# EAGLE design board (EAGLE 8.1.0)
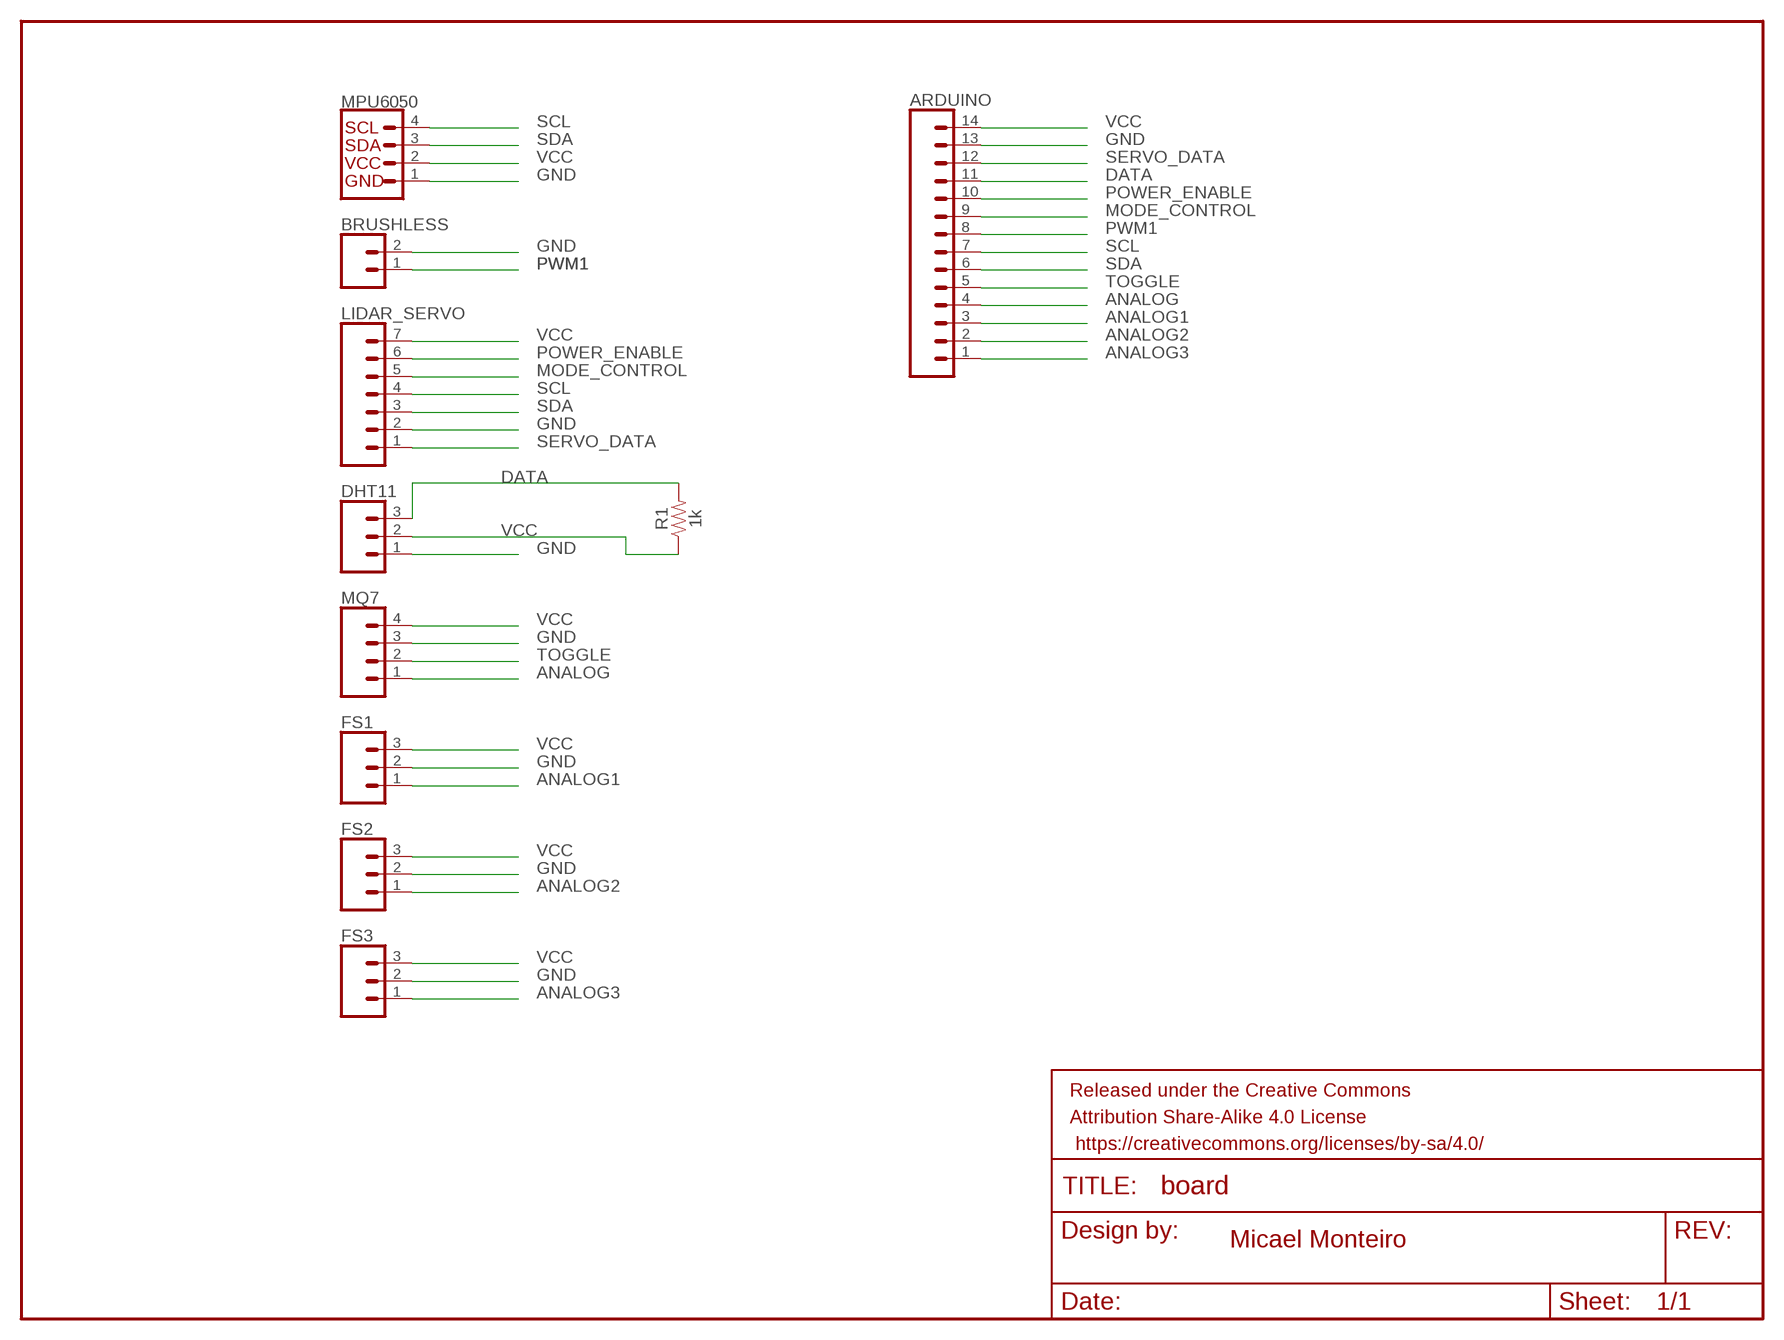
[diagram p0: schematic, sheet 1]

## Parts
ARDUINO  CONN_14  [1X14]
BRUSHLESS  CONN_02  [1X02]
DHT11  CONN_03  [1X03]
FRAME1  FRAME-LETTER  [CREATIVE_COMMONS]
FS1  CONN_03  [1X03]
FS2  CONN_03  [1X03]
FS3  CONN_03  [1X03]
LIDAR_SERVO  CONN_07  [1X07]
MPU6050  I2C_STANDARD  [1X04]
MQ7  CONN_04  [1X04]
R1  1k  1KOHM-0603-1/10W-1%  [0603]

## Nets
ANALOG: ARDUINO.4 MQ7.1
ANALOG1: ARDUINO.3 FS1.1
ANALOG2: ARDUINO.2 FS2.1
ANALOG3: ARDUINO.1 FS3.1
DATA: ARDUINO.11 DHT11.3 R1.2
GND: ARDUINO.13 BRUSHLESS.2 DHT11.1 FS1.2 FS2.2 FS3.2 LIDAR_SERVO.2 MPU6050.1 MQ7.3
MODE_CONTROL: ARDUINO.9 LIDAR_SERVO.5
POWER_ENABLE: ARDUINO.10 LIDAR_SERVO.6
PWM1: ARDUINO.8 BRUSHLESS.1
SCL: ARDUINO.7 LIDAR_SERVO.4 MPU6050.4
SDA: ARDUINO.6 LIDAR_SERVO.3 MPU6050.3
SERVO_DATA: ARDUINO.12 LIDAR_SERVO.1
TOGGLE: ARDUINO.5 MQ7.2
VCC: ARDUINO.14 DHT11.2 FS1.3 FS2.3 FS3.3 LIDAR_SERVO.7 MPU6050.2 MQ7.4 R1.1

## Notes on the sheet
- Micael Monteiro

## Library data of the parts
ARDUINO = SparkFun-Connectors:CONN_14: Multi connection point. Often used as Generic Header-pin footprint for 0.1 inch spaced/style header connections On any of the 0.1 inch spaced packages, you can populate with these: Break Away Headers - Straight <https://www.sparkfun.com/products/116> (PRT-00116) Break Away Male Headers - Right Angle <https://www.sparkfun.com/products/553> (PRT-00553) Female Headers <https://www.sparkfun.com/products/115> (PRT-00115) Break Away Headers - Machine Pin <https://www.sparkfun.com/products/117> (PRT-00117) Break Away Female Headers - Swiss Machine Pin <https://www.sparkfun.com/products/743> (PRT-00743) For SCREWTERMINALS and SPRING TERMINALS visit here: Screw Terimnals on SparkFun.com <https://www.sparkfun.com/search/results?term=Screw+Terminals> (5mm/3.5mm/2.54mm spacing) This device is also useful as a general connection point to wire up your design to another part of your project. Our various solder wires solder well into these plated through hole pads. Hook-Up Wire - Assortment (Stranded, 22 AWG) <https://www.sparkfun.com/products/11375> (PRT-11375) Hook-Up Wire - Assortment (Solid Core, 22 AWG) <https://www.sparkfun.com/products/11367> (PRT-11367) View the entire wire category on our website here <https://www.sparkfun.com/categories/141> Special notes: Molex polarized connector foot print use with SKU : PRT-08231 with associated crimp pins and housings. 1MM SMD Version SKU: PRT-10208 NOTES ON THE VARIANTS LOCK and LOCK_LONGPADS... This footprint was designed to help hold the alignment of a through-hole component (i.e. 6-pin header) while soldering it into place. You may notice that each hole has been shifted either up or down by 0.005 of an inch from it's more standard position (which is a perfectly straight line). This slight alteration caused the pins (the squares in the middle) to touch the edges of the holes. Because they are alternating, it causes a "brace" to hold the component in place. 0.005 has proven to be the perfect amount of "off-center" position when using our standard breakaway headers. Although looks a little odd when you look at the bare footprint, once you have a header in there, the alteration is very hard to notice. Also,if you push a header all the way into place, it is covered up entirely on the bottom side.
BRUSHLESS = SparkFun-Connectors:CONN_02: Multi connection point. Often used as Generic Header-pin footprint for 0.1 inch spaced/style header connections On any of the 0.1 inch spaced packages, you can populate with these: Break Away Headers - Straight <https://www.sparkfun.com/products/116> (PRT-00116) Break Away Male Headers - Right Angle <https://www.sparkfun.com/products/553> (PRT-00553) Female Headers <https://www.sparkfun.com/products/115> (PRT-00115) Break Away Headers - Machine Pin <https://www.sparkfun.com/products/117> (PRT-00117) Break Away Female Headers - Swiss Machine Pin <https://www.sparkfun.com/products/743> (PRT-00743) For SCREWTERMINALS and SPRING TERMINALS visit here: Screw Terimnals on SparkFun.com <https://www.sparkfun.com/search/results?term=Screw+Terminals> (5mm/3.5mm/2.54mm spacing) This device is also useful as a general connection point to wire up your design to another part of your project. Our various solder wires solder well into these plated through hole pads. Hook-Up Wire - Assortment (Stranded, 22 AWG) <https://www.sparkfun.com/products/11375> (PRT-11375) Hook-Up Wire - Assortment (Solid Core, 22 AWG) <https://www.sparkfun.com/products/11367> (PRT-11367) View the entire wire category on our website here <https://www.sparkfun.com/categories/141> Special notes: Molex polarized connector foot print use with: PRT-08233 with associated crimp pins and housings. 2.54_SCREWTERM for use with PRT-10571. 3.5mm Screw Terminal footprints for PRT-08084 5mm Screw Terminal footprints for use with PRT-08432
DHT11 FS1-FS3 = SparkFun-Connectors:CONN_03: Multi connection point. Often used as Generic Header-pin footprint for 0.1 inch spaced/style header connections On any of the 0.1 inch spaced packages, you can populate with these: Break Away Headers - Straight <https://www.sparkfun.com/products/116> (PRT-00116) Break Away Male Headers - Right Angle <https://www.sparkfun.com/products/553> (PRT-00553) Female Headers <https://www.sparkfun.com/products/115> (PRT-00115) Break Away Headers - Machine Pin <https://www.sparkfun.com/products/117> (PRT-00117) Break Away Female Headers - Swiss Machine Pin <https://www.sparkfun.com/products/743> (PRT-00743) Stackable Header - 3 Pin (Female, 0.1") <https://www.sparkfun.com/products/13875> (PRT-13875) For SCREWTERMINALS and SPRING TERMINALS visit here: Screw Terimnals on SparkFun.com <https://www.sparkfun.com/search/results?term=Screw+Terminals> (5mm/3.5mm/2.54mm spacing) This device is also useful as a general connection point to wire up your design to another part of your project. Our various solder wires solder well into these plated through hole pads. Hook-Up Wire - Assortment (Stranded, 22 AWG) <https://www.sparkfun.com/products/11375> (PRT-11375) Hook-Up Wire - Assortment (Solid Core, 22 AWG) <https://www.sparkfun.com/products/11367> (PRT-11367) View the entire wire category on our website here <https://www.sparkfun.com/categories/141> Special notes: Molex polarized connector foot print use with SKU : PRT-08232 with associated crimp pins and housings.
FRAME1 = SparkFun-Aesthetics:FRAME-LETTER: Schematic Frame - Letter Standard 8.5x11 US Letter frame
LIDAR_SERVO = SparkFun-Connectors:CONN_07: Multi connection point. Often used as Generic Header-pin footprint for 0.1 inch spaced/style header connections On any of the 0.1 inch spaced packages, you can populate with these: Break Away Headers - Straight <https://www.sparkfun.com/products/116> (PRT-00116) Break Away Male Headers - Right Angle <https://www.sparkfun.com/products/553> (PRT-00553) Female Headers <https://www.sparkfun.com/products/115> (PRT-00115) Break Away Headers - Machine Pin <https://www.sparkfun.com/products/117> (PRT-00117) Break Away Female Headers - Swiss Machine Pin <https://www.sparkfun.com/products/743> (PRT-00743) For SCREWTERMINALS and SPRING TERMINALS visit here: Screw Terimnals on SparkFun.com <https://www.sparkfun.com/search/results?term=Screw+Terminals> (5mm/3.5mm/2.54mm spacing) This device is also useful as a general connection point to wire up your design to another part of your project. Our various solder wires solder well into these plated through hole pads. Hook-Up Wire - Assortment (Stranded, 22 AWG) <https://www.sparkfun.com/products/11375> (PRT-11375) Hook-Up Wire - Assortment (Solid Core, 22 AWG) <https://www.sparkfun.com/products/11367> (PRT-11367) View the entire wire category on our website here <https://www.sparkfun.com/categories/141> Special notes: Molex polarized connector foot print use with SKU : PRT-08231 with associated crimp pins and housings. 1MM SMD Version SKU: PRT-10208 NOTES ON THE VARIANTS LOCK and LOCK_LONGPADS... This footprint was designed to help hold the alignment of a through-hole component (i.e. 6-pin header) while soldering it into place. You may notice that each hole has been shifted either up or down by 0.005 of an inch from it's more standard position (which is a perfectly straight line). This slight alteration caused the pins (the squares in the middle) to touch the edges of the holes. Because they are alternating, it causes a "brace" to hold the component in place. 0.005 has proven to be the perfect amount of "off-center" position when using our standard breakaway headers. Although looks a little odd when you look at the bare footprint, once you have a header in there, the alteration is very hard to notice. Also,if you push a header all the way into place, it is covered up entirely on the bottom side.
MPU6050 = SparkFun-Connectors:I2C_STANDARD: SparkFun I2C Standard Pinout Header SparkFun has standardized on a pinout for all I2C based sensor breakouts. This pinout allows I2C boards to be plugged directly into the headers on Arduino Uno compatible boards, and to be daisy chained easily. Example SparkFun Products: SparkFun Atmospheric Sensor Breakout - BME280 <https://www.sparkfun.com/products/13676> SparkFun Altitude/Pressure Sensor Breakout - MPL3115A2 <https://www.sparkfun.com/products/11084> SparkFun TOF Range Finder Sensor - VL6180 <https://www.sparkfun.com/products/12785>
MQ7 = SparkFun-Connectors:CONN_04: Multi connection point. Often used as Generic Header-pin footprint for 0.1 inch spaced/style header connections On any of the 0.1 inch spaced packages, you can populate with these: Break Away Headers - Straight <https://www.sparkfun.com/products/116> (PRT-00116) Break Away Male Headers - Right Angle <https://www.sparkfun.com/products/553> (PRT-00553) Female Headers <https://www.sparkfun.com/products/115> (PRT-00115) Break Away Headers - Machine Pin <https://www.sparkfun.com/products/117> (PRT-00117) Break Away Female Headers - Swiss Machine Pin <https://www.sparkfun.com/products/743> (PRT-00743) For SCREWTERMINALS and SPRING TERMINALS visit here: Screw Terimnals on SparkFun.com <https://www.sparkfun.com/search/results?term=Screw+Terminals> (5mm/3.5mm/2.54mm spacing) This device is also useful as a general connection point to wire up your design to another part of your project. Our various solder wires solder well into these plated through hole pads. Hook-Up Wire - Assortment (Stranded, 22 AWG) <https://www.sparkfun.com/products/11375> (PRT-11375) Hook-Up Wire - Assortment (Solid Core, 22 AWG) <https://www.sparkfun.com/products/11367> (PRT-11367) View the entire wire category on our website here <https://www.sparkfun.com/categories/141> Special notes: Molex polarized connector foot print use with SKU : PRT-08231 with associated crimp pins and housings. 1MM SMD Version SKU: PRT-10208; PROD_ID: CONN-09696
R1 = SparkFun-Resistors:1KOHM: 1kΩ resistor A resistor is a passive two-terminal electrical component that implements electrical resistance as a circuit element. Resistors act to reduce current flow, and, at the same time, act to lower voltage levels within circuits. - Wikipedia; PROD_ID: RES-07856

## Board
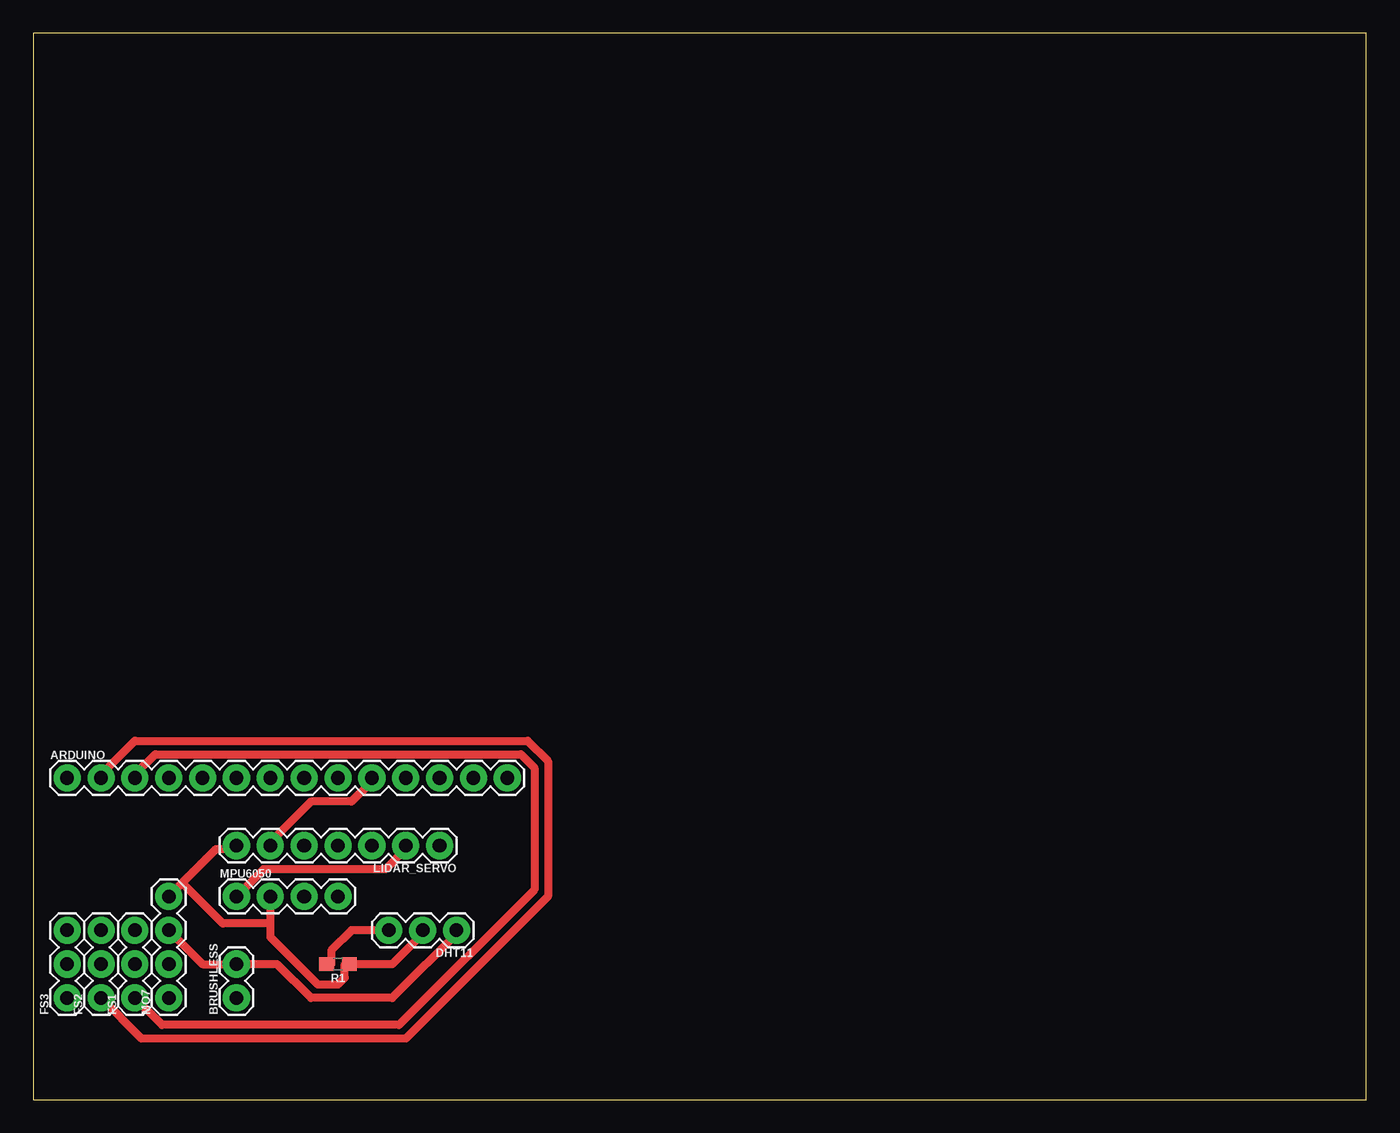
[diagram p1: board, top side]
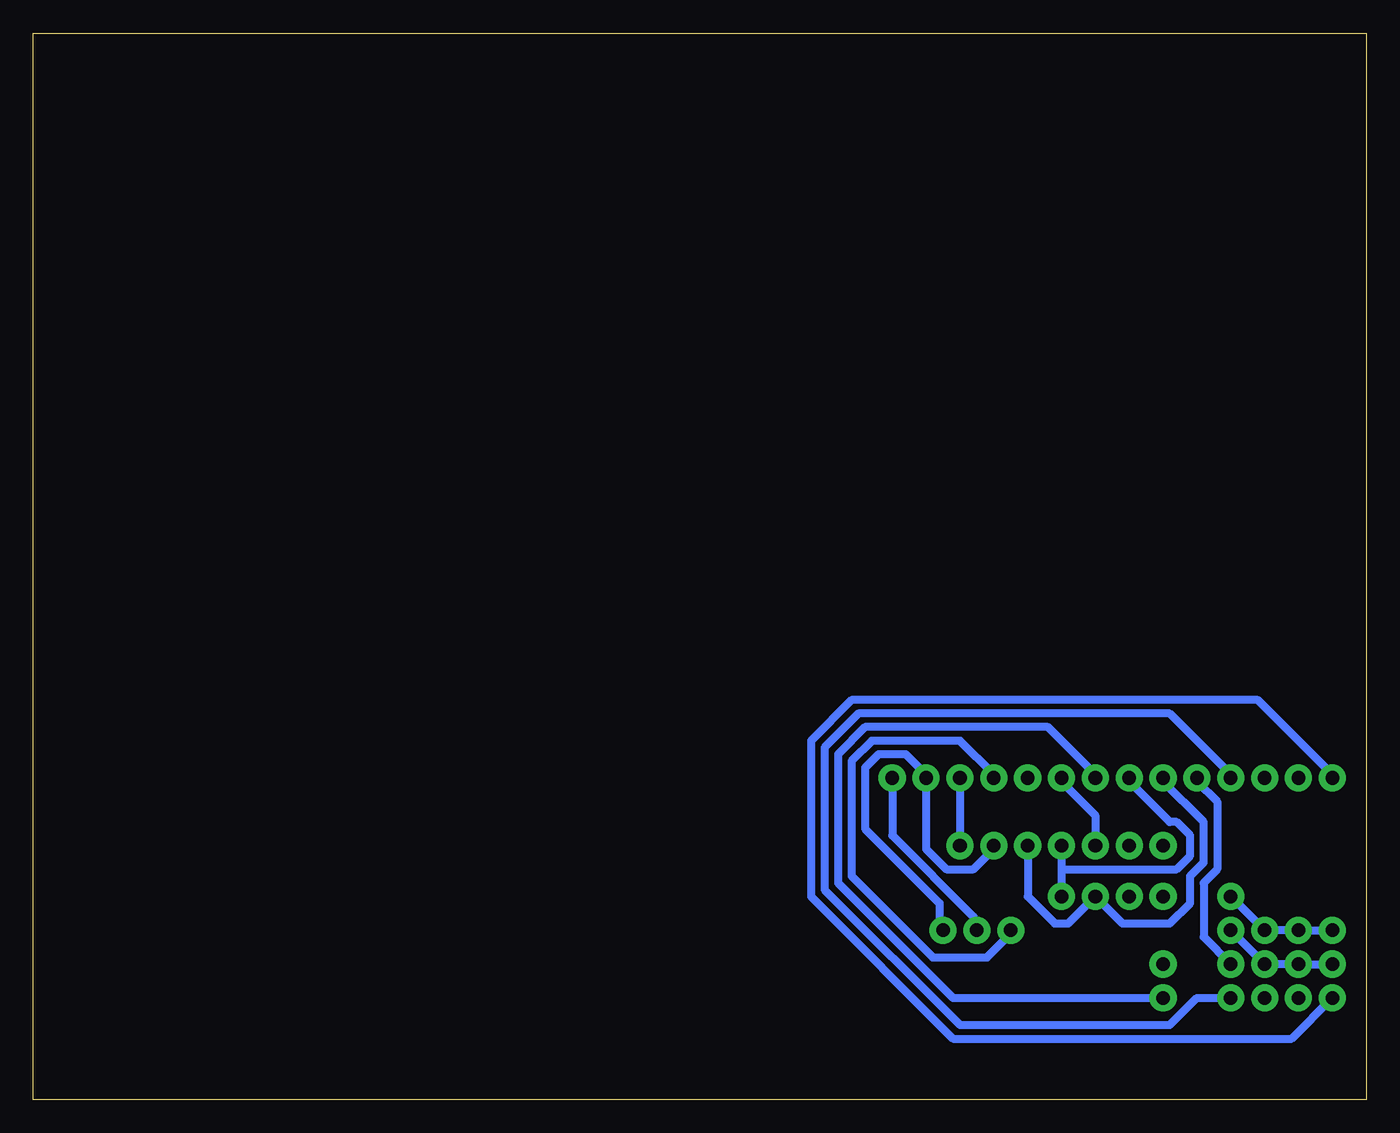
[diagram p2: board, bottom side, seen from below]

Size 100 x 80 mm. Coordinates in mm from the lower left corner, seen from the top.
Outline: 0,0 100,0 100,80 0,80 0,0
Copper layers (1*16): Top 0.035mm / dielectric 1.5mm / Bottom 0.035mm
Design rules "projectboard_DETI": minimum track width 24mil, minimum drill 1mm, track to track 16mil, track to pad 16mil, pad to pad 16mil, via to via 16mil, smd to smd 8mil, copper to edge 20mil, drill to drill 8mil, minimum pad ring 20mil, minimum via ring 8mil, stop-mask expansion 4mil, vias tented up to drill 0mil, thermal gap 10mil

### Footprints (pad centres in the part's own frame; a part is rotated, then mirrored left to right if it is on the bottom)
1X14 = drill 1.016 pad 1.88: 1 0,0; 2 2.54,0; 3 5.08,0; 4 7.62,0; 5 10.16,0; 6 12.7,0; 7 15.24,0; 8 17.78,0; 9 20.32,0; 10 22.86,0; 11 25.4,0; 12 27.94,0; 13 30.48,0; 14 33.02,0
1X02 = drill 1.016 pad 1.88: 1 0,0; 2 2.54,0
1X03 = drill 1.016 pad 1.88: 1 0,0; 2 2.54,0; 3 5.08,0
1X07 = drill 1.016 pad 1.88: 1 0,0; 2 2.54,0; 3 5.08,0; 4 7.62,0; 5 10.16,0; 6 12.7,0; 7 15.24,0
1X04 = drill 1.016 pad 1.88: 1 0,0; 2 2.54,0; 3 5.08,0; 4 7.62,0
0603 = smd 1.1 x 1: 1 -0.85,0; 2 0.85,0

### Placement (x,y rotation side)
ARDUINO  2.54,24.13 0 top
BRUSHLESS  15.24,7.62 90 top
DHT11  31.75,12.7 180 top
FRAME1  -101.6,1.27 0 top  (outside the outline)
FS1  7.62,7.62 90 top
FS2  5.08,7.62 90 top
FS3  2.54,7.62 90 top
LIDAR_SERVO  30.48,19.05 180 top
MPU6050  15.24,15.24 0 top
MQ7  10.16,7.62 90 top
R1  22.86,10.16 180 top

### Tracks (layer width: path | path; a pad name or v marks a point on that pad's centre or on a via)
ANALOG
  Bottom 0.61: MQ7.1 12.7,7.62 14.73,5.59 30.48,5.59 40.64,15.75 40.64,26.42 38.1,28.96 14.73,28.96 10.16,24.38 ARDUINO.4
ANALOG1
  Top 0.61: FS1.1 9.65,5.59 27.43,5.59 37.59,15.75 37.59,24.89 36.58,25.91 9.14,25.91 7.62,24.38 ARDUINO.3
ANALOG2
  Top 0.61: FS2.1 8.13,4.57 27.94,4.57 38.61,15.24 38.61,25.4 37.08,26.92 7.62,26.92 5.08,24.38 ARDUINO.2
ANALOG3
  Bottom 0.61: FS3.1 5.59,4.57 30.99,4.57 41.66,15.24 41.66,26.92 38.61,29.97 8.13,29.97 2.54,24.38 ARDUINO.1
DATA
  Top 0.61: DHT11.3 23.88,12.7 22.35,11.18 22.35,10.16 R1.2
  Bottom 0.61: DHT11.3 26.92,12.7 26.92,12.19 28.45,10.67 32.51,10.67 38.61,16.76 38.61,25.4 37.08,26.92 30.48,26.92 27.94,24.38 ARDUINO.11
GND
  Top 0.61: MQ7.3 12.7,10.16 BRUSHLESS.2 18.29,10.16 20.83,7.62 26.92,7.62 32,12.7 DHT11.1 | MPU6050.1 17.27,17.27 26.42,17.27 27.94,18.8 LIDAR_SERVO.2
  Bottom 0.61: FS3.2 FS2.2 FS1.2 MQ7.3 | DHT11.1 32,12.7 32,14.73 37.59,20.32 37.59,24.89 36.58,25.91 34.54,25.91 33.02,24.38 ARDUINO.13 33.02,18.8 31.5,17.27 29.46,17.27 27.94,18.8 LIDAR_SERVO.2
MODE_CONTROL
  Bottom 0.61: LIDAR_SERVO.5 20.32,21.34 22.86,23.88 ARDUINO.9
POWER_ENABLE
  Top 0.61: LIDAR_SERVO.6 17.78,19.3 20.83,22.35 23.88,22.35 25.4,23.88 ARDUINO.10
PWM1
  Bottom 0.61: BRUSHLESS.1 30.99,7.62 39.62,16.26 39.62,25.91 37.59,27.94 23.88,27.94 20.32,24.38 ARDUINO.8
SCL
  Bottom 0.61: LIDAR_SERVO.4 22.86,17.27 | 22.86,17.27 MPU6050.4 | 22.86,17.27 14.22,17.27 13.21,18.29 13.21,19.81 14.22,20.83 14.73,20.83 17.78,23.88 ARDUINO.7
SDA
  Bottom 0.61: LIDAR_SERVO.3 25.4,15.24 23.37,13.21 22.35,13.21 MPU6050.3 18.29,13.21 14.73,13.21 13.21,14.73 13.21,16.76 12.19,17.78 12.19,20.83 15.24,23.88 ARDUINO.6
SERVO_DATA
  Bottom 0.61: ARDUINO.12 LIDAR_SERVO.1
TOGGLE
  Bottom 0.61: MQ7.2 12.19,12.19 12.19,16.26 11.18,17.27 11.18,22.35 12.7,23.88 ARDUINO.5
VCC
  Top 0.61: MQ7.4 11.18,16.26 | 11.18,16.26 13.72,18.8 15.24,18.8 LIDAR_SERVO.7 | DHT11.2 29.46,12.7 26.92,10.16 R1.1 23.37,10.16 23.37,9.14 22.86,8.64 21.34,8.64 17.78,12.19 17.78,13.21 | MPU6050.2 17.78,13.21 | 11.18,16.26 14.22,13.21 17.78,13.21
  Bottom 0.61: FS3.3 FS2.3 FS1.3 MQ7.4 | ARDUINO.14 35.56,19.81 29.46,13.72 29.46,12.7 DHT11.2